# EAGLE design stm32H7_experimenter10 (EAGLE 6.5.0)
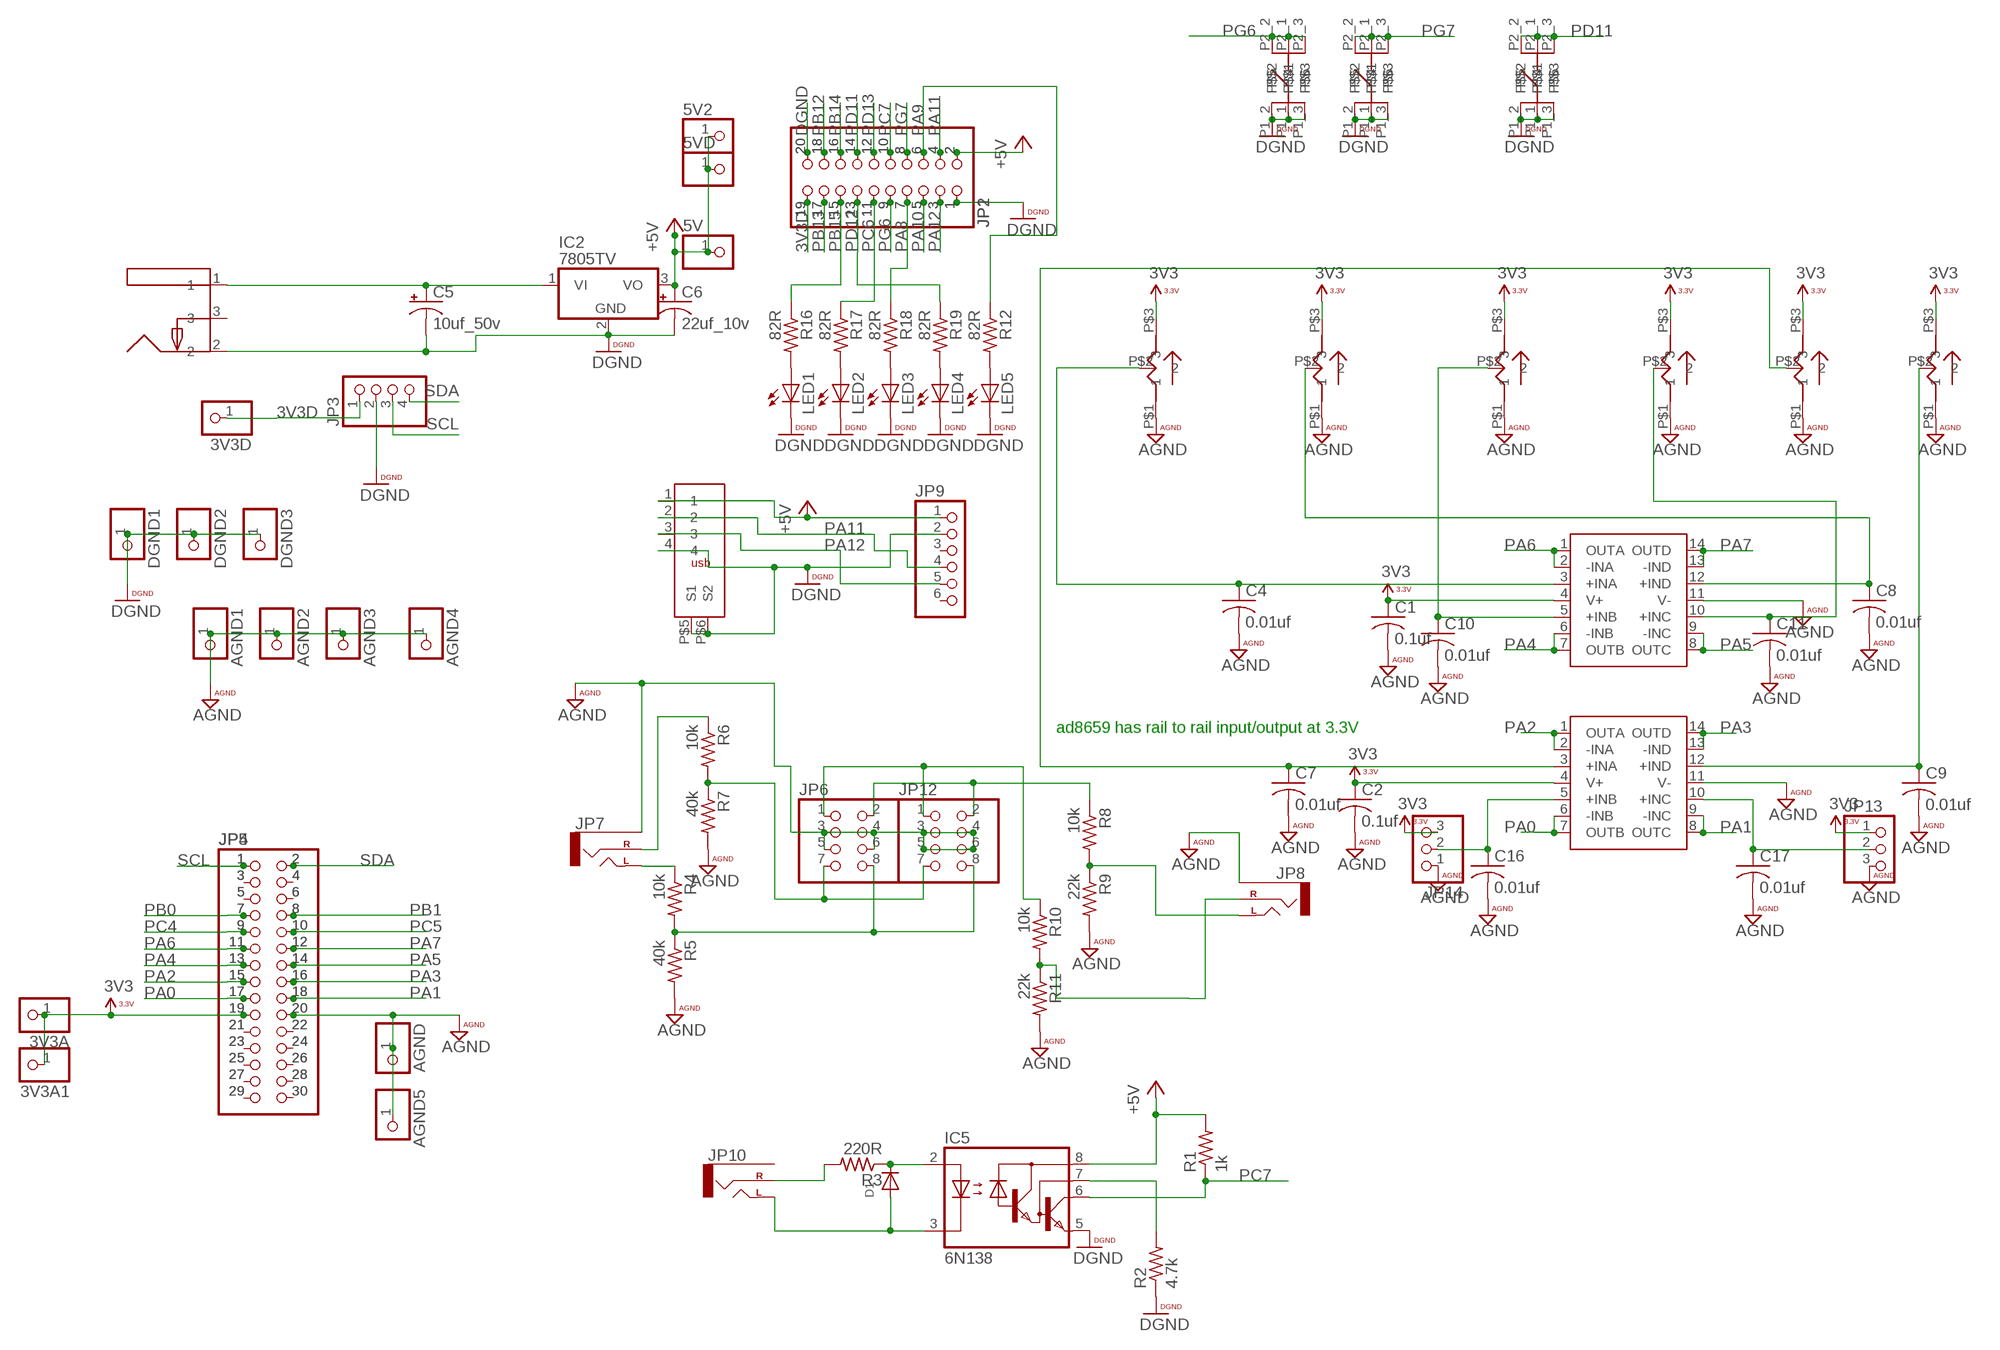
[diagram p0: schematic, sheet 1]

## Parts
3V3A  PINHD-1X1  [1X01]
3V3A1  PINHD-1X1  [1X01]
3V3D  PINHD-1X1  [1X01]
5V  PINHD-1X1  [1X01]
5V2  PINHD-1X1  [1X01]
5VD  PINHD-1X1  [1X01]
AGND  PINHD-1X1  [1X01]
AGND1  PINHD-1X1  [1X01]
AGND2  PINHD-1X1  [1X01]
AGND3  PINHD-1X1  [1X01]
AGND4  PINHD-1X1  [1X01]
AGND5  PINHD-1X1  [1X01]
C1  0.1uf  C-US025-030X050  [C025-030X050]
C2  0.1uf  C-US025-030X050  [C025-030X050]
C4  0.01uf  C-US025-030X050  [C025-030X050]
C5  10uf_50v  CPOL-USSMCC  [SMC_C]
C6  22uf_10v  CPOL-USSMCC  [SMC_C]
C7  0.01uf  C-US025-030X050  [C025-030X050]
C8  0.01uf  C-US025-030X050  [C025-030X050]
C9  0.01uf  C-US025-030X050  [C025-030X050]
C10  0.01uf  C-US025-030X050  [C025-030X050]
C11  0.01uf  C-US025-030X050  [C025-030X050]
C16  0.01uf  C-US025-030X050  [C025-030X050]
C17  0.01uf  C-US025-030X050  [C025-030X050]
D1  DIODEDO-1N4148  [DO-1N4148]
DGND1  PINHD-1X1  [1X01]
DGND2  PINHD-1X1  [1X01]
DGND3  PINHD-1X1  [1X01]
IC1  AD8659  [SO14]
IC2  7805TV  [TO220V]
IC3  AD8659  [SO14]
IC5  6N138  [DIL08]
JP1  PINHD-2X10  [2X10]
JP2  PINHD-2X10  [2X10]
JP3  PINHD-1X4  [1X04]
JP4  PINHD-2X15  [2X15]
JP5  PINHD-2X15  [2X15]
JP6  PINHD-2X4  [2X04]
JP7  AUDIO-JACKPTH  [AUDIO-JACK]
JP8  AUDIO-JACKPTH  [AUDIO-JACK]
JP9  PINHD-1X6  [1X06]
JP10  AUDIO-JACKPTH  [AUDIO-JACK]
JP12  PINHD-2X4  [2X04]
JP13  PINHD-1X3  [1X03]
JP14  PINHD-1X3  [1X03]
LED1  LED3MM  [LED3MM]
LED2  LED3MM  [LED3MM]
LED3  LED3MM  [LED3MM]
LED4  LED3MM  [LED3MM]
LED5  LED3MM  [LED3MM]
P1  RK09SONGHUEI  [R0904N]
P2  RK09SONGHUEI  [R0904N]
P3  RK09SONGHUEI  [R0904N]
P4  RK09SONGHUEI  [R0904N]
P5  RK09SONGHUEI  [R0904N]
P6  RK09SONGHUEI  [R0904N]
R1  1k  R-US_0204/5  [0204/5]
R2  4.7k  R-US_0204/5  [0204/5]
R3  220R  R-US_0204/5  [0204/5]
R4  10k  R-US_0204/5  [0204/5]
R5  40k  R-US_0204/5  [0204/5]
R6  10k  R-US_0204/5  [0204/5]
R7  40k  R-US_0204/5  [0204/5]
R8  10k  R-US_0204/5  [0204/5]
R9  22k  R-US_0204/5  [0204/5]
R10  10k  R-US_0204/5  [0204/5]
R11  22k  R-US_0204/5  [0204/5]
R12  82R  R-US_0204/5  [0204/5]
R16  82R  R-US_0204/2V  [0204V]
R17  82R  R-US_0204/2V  [0204V]
R18  82R  R-US_0204/5  [0204/5]
R19  82R  R-US_0204/5  [0204/5]
S1  TL52_PLUS  [TL52_PLUS]
S2  TL52_PLUS  [TL52_PLUS]
S3  TL52_PLUS  [TL52_PLUS]
U$1  PJ-058AH_PWR_JACK  [PJ-058AH]
U$3  USB_292303-1  [292303]

## Nets
3V3A: 3V3A1.1 3V3A.1 C1.1 C2.1 IC1.4(V+) IC3.4(V+) JP4.19 JP5.19 JP13.1 JP14.3 P1.P$3 P2.P$3 P3.P$3 P4.P$3 P5.P$3 P6.P$3 ; supply symbol labelled 3V3
3V3D: 3V3D.1 JP1.19 JP2.19 JP3.1
+5V: 5V2.1 5V.1 5VD.1 C6.+ IC2.3(VO) IC5.8(VCC) JP1.2 JP2.2 JP9.1 R1.2 U$3.1
AGND: AGND1.1 AGND2.1 AGND3.1 AGND4.1 AGND5.1 AGND.1 C1.2 C2.2 C4.2 C7.2 C8.2 C9.2 C10.2 C11.2 C16.2 C17.2 IC1.11(V-) IC3.11(V-) JP4.20 JP5.20 JP6.3 JP6.4 JP6.5 JP6.6 JP7.SLEEVE JP8.SLEEVE JP12.3 JP12.4 JP12.5 JP12.6 JP13.3 JP14.1 P1.P$1 P2.P$1 P3.P$1 P4.P$1 P5.P$1 P6.P$1 R5.2 R7.2 R9.2 R11.2
DGND: C5.- C6.- DGND1.1 DGND2.1 DGND3.1 IC2.2(GND) IC5.5(GND) JP1.1 JP1.20 JP2.1 JP2.20 JP3.2 JP9.2 LED1.K(C) LED2.K(C) LED3.K(C) LED4.K(C) LED5.K(C) R2.1 S1.P1_1 S1.P1_2 S1.P1_3 S2.P1_1 S2.P1_2 S2.P1_3 S3.P1_1 S3.P1_2 S3.P1_3 U$1.2 U$3.4 U$3.P$5(S1) U$3.P$6(S2)
N$1: D1.A IC5.3(C) JP10.TIP(LEFT)
N$2: D1.C IC5.2(A) R3.1
N$3: IC5.7(VB) R2.2
N$4: JP10.RING(RIGHT) R3.2
N$5: C4.1 IC1.3(+INA) P1.P$2
N$6: C8.1 IC1.12(+IND) P2.P$2
N$7: C10.1 IC1.5(+INB) P3.P$2
N$8: C11.1 IC1.10(+INC) P4.P$2
N$9: JP4.3 JP5.3
N$10: JP4.4 JP5.4
N$11: JP4.5 JP5.5
N$12: JP4.6 JP5.6
N$13: C7.1 IC3.3(+INA) P5.P$2
N$14: C9.1 IC3.12(+IND) P6.P$2
N$15: JP4.21 JP5.21
N$16: JP4.22 JP5.22
N$17: C5.+ IC2.1(VI) U$1.1
N$18: C16.1 IC3.5(+INB) JP14.2
N$19: JP6.8 JP12.8 R4.2 R5.1
N$20: JP6.7 JP12.7 R6.2 R7.1
N$21: LED5.A R12.2
N$22: JP7.TIP(LEFT) R4.1
N$23: JP8.TIP(LEFT) R8.2 R9.1
N$24: C17.1 IC3.10(+INC) JP13.2
N$25: JP7.RING(RIGHT) R6.1
N$26: JP6.2 JP12.2 R8.1
N$27: JP8.RING(RIGHT) R10.2 R11.1
N$28: JP6.1 JP12.1 R10.1
N$31: LED1.A R16.2
N$32: LED2.A R17.2
N$33: LED3.A R18.2
N$34: LED4.A R19.2
N$37: JP4.23 JP5.23
N$38: JP4.24 JP5.24
N$39: JP4.25 JP5.25
N$40: JP4.26 JP5.26
N$41: JP4.27 JP5.27
N$42: JP4.28 JP5.28
N$43: JP4.29 JP5.29
N$44: JP4.30 JP5.30
PA0: IC3.6(-INB) IC3.7(OUTB) JP4.17 JP5.17
PA1: IC3.8(OUTC) IC3.9(-INC) JP4.18 JP5.18
PA2: IC3.1(OUTA) IC3.2(-INA) JP4.15 JP5.15
PA3: IC3.13(-IND) IC3.14(OUTD) JP4.16 JP5.16
PA4: IC1.6(-INB) IC1.7(OUTB) JP4.13 JP5.13
PA5: IC1.8(OUTC) IC1.9(-INC) JP4.14 JP5.14
PA6: IC1.1(OUTA) IC1.2(-INA) JP4.11 JP5.11
PA7: IC1.13(-IND) IC1.14(OUTD) JP4.12 JP5.12
PA8: JP1.7 JP2.7 R18.1
PA9: JP1.6 JP2.6 R12.1
PA10: JP1.5 JP2.5
PA11: JP1.4 JP2.4 JP9.4 U$3.2
PA12: JP1.3 JP2.3 JP9.5 U$3.3
PB0: JP4.7 JP5.7
PB1: JP4.8 JP5.8
PB12: JP1.18 JP2.18
PB13: JP1.17 JP2.17
PB14: JP1.16 JP2.16
PB15: JP1.15 JP2.15 R16.1
PC4: JP4.9 JP5.9
PC5: JP4.10 JP5.10
PC6: JP1.11 JP2.11 R17.1
PC7: IC5.6(VO) JP1.10 JP2.10 R1.1
PD11: JP1.14 JP2.14 S3.P2_1 S3.P2_2 S3.P2_3
PD12: JP1.13 JP2.13 R19.1
PD13: JP1.12 JP2.12
PG6: JP1.9 JP2.9 S1.P2_1 S1.P2_2 S1.P2_3
PG7: JP1.8 JP2.8 S2.P2_1 S2.P2_2 S2.P2_3
SCL: JP3.3 JP4.1 JP5.1
SDA: JP3.4 JP4.2 JP5.2
Unconnected: JP9.3 JP9.6 JP10.SLEEVE U$1.3

## Notes on the sheet
- ad8659 has rail to rail input/output at 3.3V

## Library data of the parts
3V3A 3V3A1 3V3D 5V 5V2 5VD AGND AGND1-AGND5 DGND1-DGND3 = adafruit:PINHD-1X1: Pin header 1x1 for 0.1" spacing With round pins; PARTNO: *DNP
C1 C2 = adafruit:C-US: CAPACITOR, American symbol; PARTNO: K104K15X7RF5TL2
C4 C7-C11 C16 C17 = adafruit:C-US: CAPACITOR, American symbol; PARTNO: K103K15X7RF5TL2
C5 = rcl:CPOL-US: POLARIZED CAPACITOR, American symbol; PARTNO: 293D106X9035C2TE3
C6 = rcl:CPOL-US: POLARIZED CAPACITOR, American symbol; PARTNO: T491C226K016AT
D1 = adafruit:DIODE: Diode SMADIODE - SMA Surface Mount Package 20V 1A Schottky Diode Digikey: 641-1014-6-ND DO-1N4148 - Through Hole Small Current Diode SOD-123 20V 1 A (.5mV Vf) Schottky Diode - Digikey: MBRX120TPMSCT-ND SOD-323 10V 570mA (.38mV Vf, 3ns) Schottky Diode - Digikey: ZLLS410CT-ND SOD-523 30V 30mA Schottky Diode (RB751S-40TE61) - Digikey: RB751S-40TE61CT-ND SOT23-R/W - SOT23 Package (R = Solder Paste/Reflow Ovens, W = Hand-Soldering) BAT54Film 40V 300mA - Digikey: 497-7162-1-ND; PARTNO: 1N4148
IC1 IC3 = custom:AD8659; PARTNO: AD8659ARZ-R7
IC2 = linear:78*: Positive VOLTAGE REGULATOR Source: http://cache.national.com/ds/LM/LM78L05.pdf http://www.fairchildsemi.com/ds/LM/LM7805.pdf; PARTNO: VX7805-1000
IC5 = optocoupler:6N138: MOTOROLA OPTO COUPLER; MF: VISHAY/TELEFUNKEN; MPN: 6N138; OC_FARNELL: 9860150; OC_NEWARK: 35K5294; PARTNO: 6N138
JP1 = SparkFun-Connectors:PINHD-2X10: PIN HEADER; PARTNO: *DNP
JP2 = SparkFun-Connectors:PINHD-2X10: PIN HEADER; PARTNO: 67996-120HLF
JP3 = pinhead:PINHD-1X4: PIN HEADER; PARTNO: *DNP
JP4 = pinhead:PINHD-2X15: PIN HEADER; PARTNO: 67996-130HLF
JP5 = pinhead:PINHD-2X15: PIN HEADER; PARTNO: *DNP
JP6 = pinhead:PINHD-2X4: PIN HEADER; PARTNO: 67996-108HLF
JP7 JP8 JP10 = SparkFun-Connectors:AUDIO-JACK: 3.5mm Audio Jack Simple 3.5mm common PCB mount audio jack. SKU: PRT-08032; PARTNO: SJ1-3525N
JP9 = adafruit:PINHD-1X6: PIN HEADER
JP12 = pinhead:PINHD-2X4: PIN HEADER; PARTNO: *DNP
JP13 JP14 = adafruit:PINHD-1X3: PIN HEADER; PARTNO: *DNP
LED1-LED5 = custom:LED: LED OSRAM: - CHIPLED LG R971, LG N971, LY N971, LG Q971, LY Q971, LO R971, LY R971 LH N974, LH R974 LS Q976, LO Q976, LY Q976 LO Q996 - Hyper CHIPLED LW Q18S LB Q993, LB Q99A, LB R99A - SideLED LS A670, LO A670, LY A670, LG A670, LP A670 LB A673, LV A673, LT A673, LW A673 LH A674 LY A675 LS A676, LA A676, LO A676, LY A676, LW A676 LS A679, LY A679, LG A679 - Hyper Micro SIDELED® LS Y876, LA Y876, LO Y876, LY Y876 LT Y87S - SmartLED LW L88C, LW L88S LB L89C, LB L89S, LG L890 LS L89K, LO L89K, LY L89K LS L896, LA L896, LO L896, LY L896 - TOPLED LS T670, LO T670, LY T670, LG T670, LP T670 LSG T670, LSP T670, LSY T670, LOP T670, LYG T670 LG T671, LOG T671, LSG T671 LB T673, LV T673, LT T673, LW T673 LH T674 LS T676, LA T676, LO T676, LY T676, LB T676, LH T676, LSB T676, LW T676 LB T67C, LV T67C, LT T67C, LS T67K, LO T67K, LY T67K, LW E67C LS E67B, LA E67B, LO E67B, LY E67B, LB E67C, LV E67C, LT E67C LW T67C LS T679, LY T679, LG T679 LS T770, LO T770, LY T770, LG T770, LP T770 LB T773, LV T773, LT T773, LW T773 LH T774 LS E675, LA E675, LY E675, LS T675 LS T776, LA T776, LO T776, LY T776, LB T776 LHGB T686 LT T68C, LB T68C - Hyper Mini TOPLED® LB M676 - Mini TOPLED Santana® LG M470 LS M47K, LO M47K, LY M47K Source: http://www.osram.convergy.de - LUMILED® LXK2-PW12-R00, LXK2-PW12-S00, LXK2-PW14-U00, LXK2-PW14-V00 LXK2-PM12-R00, LXK2-PM12-S00, LXK2-PM14-U00 LXK2-PE12-Q00, LXK2-PE12-R00, LXK2-PE12-S00, LXK2-PE14-T00, LXK2-PE14-U00 LXK2-PB12-K00, LXK2-PB12-L00, LXK2-PB12-M00, LXK2-PB14-N00, LXK2-PB14-P00, LXK2-PB14-Q00 LXK2-PR12-L00, LXK2-PR12-M00, LXK2-PR14-Q00, LXK2-PR14-R00 LXK2-PD12-Q00, LXK2-PD12-R00, LXK2-PD12-S00 LXK2-PH12-R00, LXK2-PH12-S00 LXK2-PL12-P00, LXK2-PL12-Q00, LXK2-PL12-R00 Source: www.luxeon.com; PARTNO: 151031SS04000
P1-P6 = custom:RK09; PARTNO: *
R1 = adafruit:R-US_: RESISTOR, American symbol; PARTNO: RNMF14FTC1K00
R2 = adafruit:R-US_: RESISTOR, American symbol; PARTNO: RNMF14FTC4K70
R3 = adafruit:R-US_: RESISTOR, American symbol; PARTNO: RNMF14FTC220R
R4 R6 R8 R10 = adafruit:R-US_: RESISTOR, American symbol; PARTNO: RNMF14FTC10K0
R5 R7 = adafruit:R-US_: RESISTOR, American symbol; PARTNO: RNMF14FTC39K0
R9 R11 = adafruit:R-US_: RESISTOR, American symbol; PARTNO: RNMF14FTC22K0
R12 R16-R19 = adafruit:R-US_: RESISTOR, American symbol; PARTNO: RNMF14FTC82R0
S1-S3 = custom:TL52_PLUS; PARTNO: TL52AF160Q
U$1 = custom:PJ-058AH_PWR_JACK
U$3 = custom:USB_292303-1

## Board
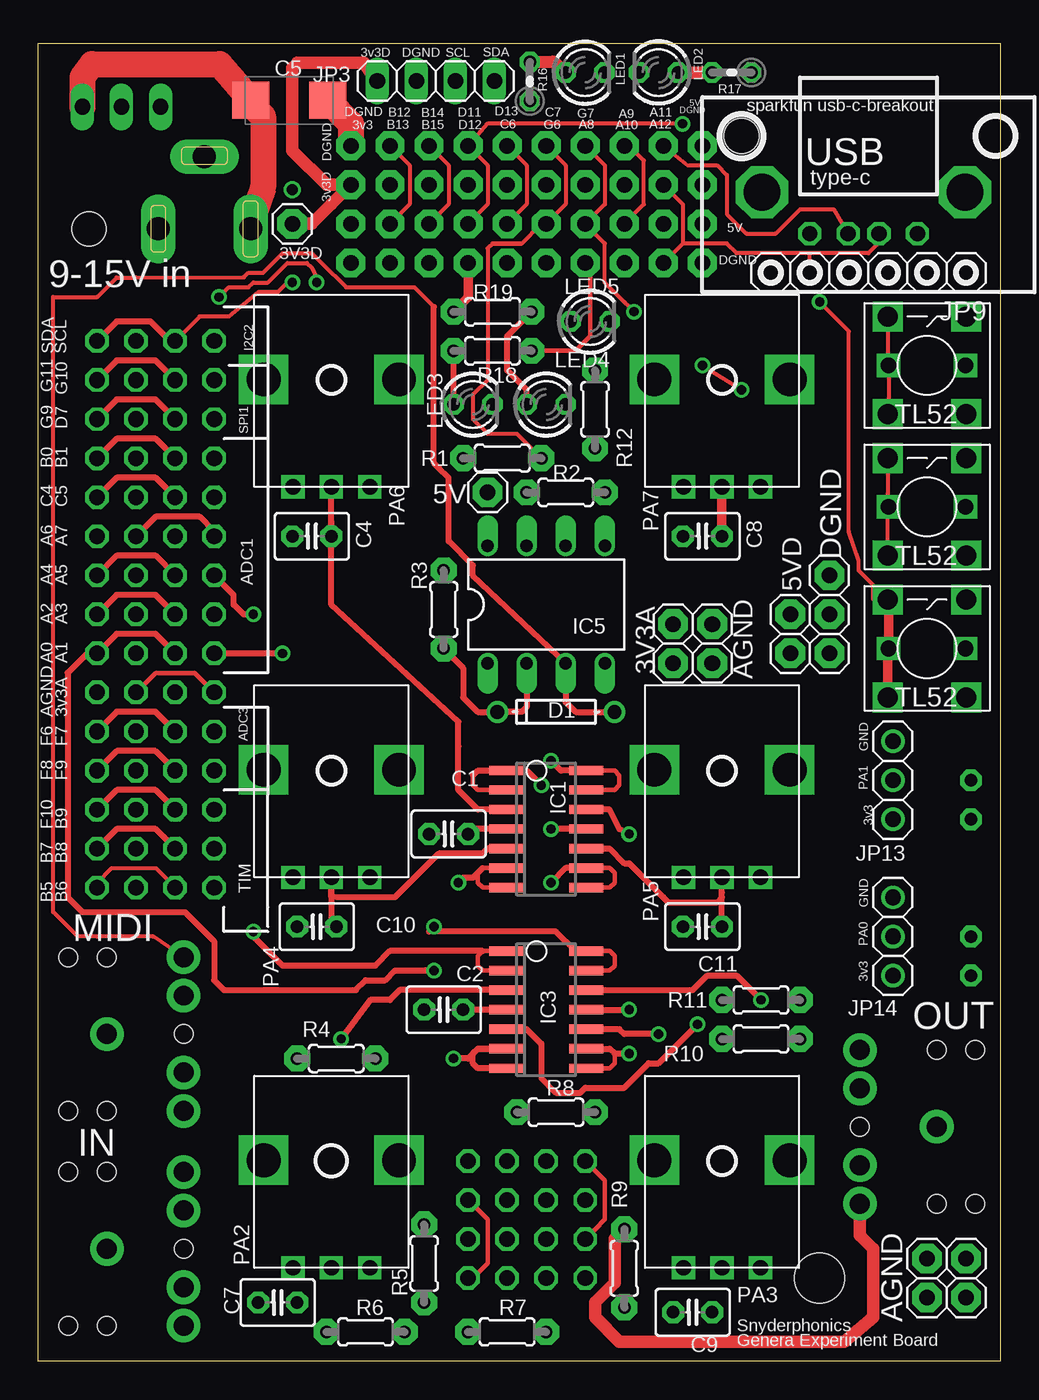
[diagram p1: board, top side]
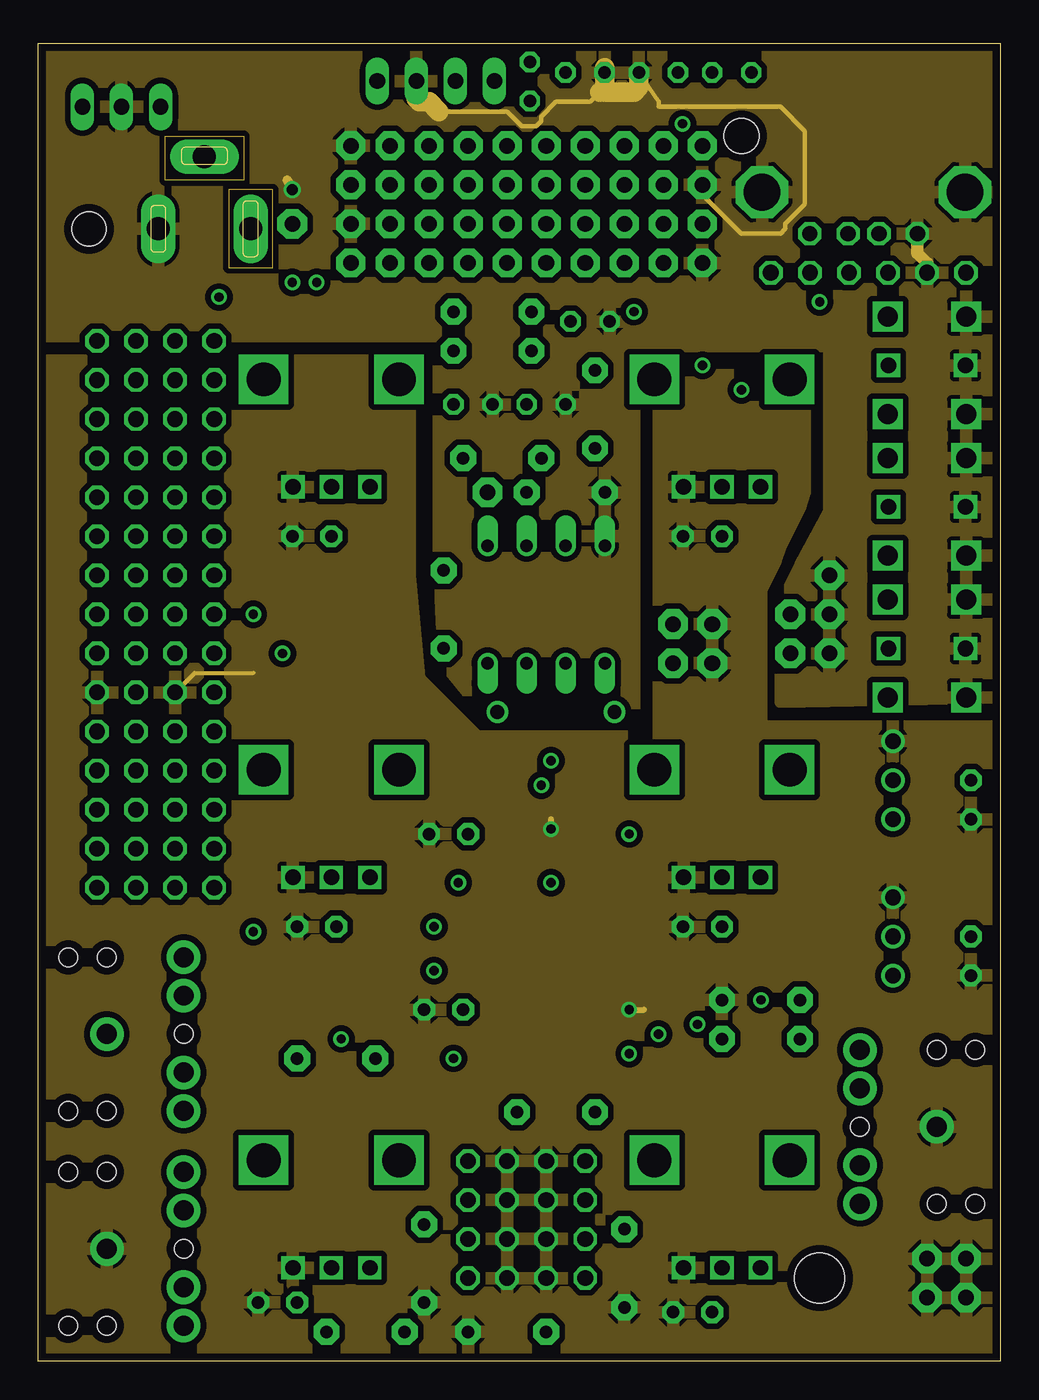
[diagram p2: board, inner layer Route2]
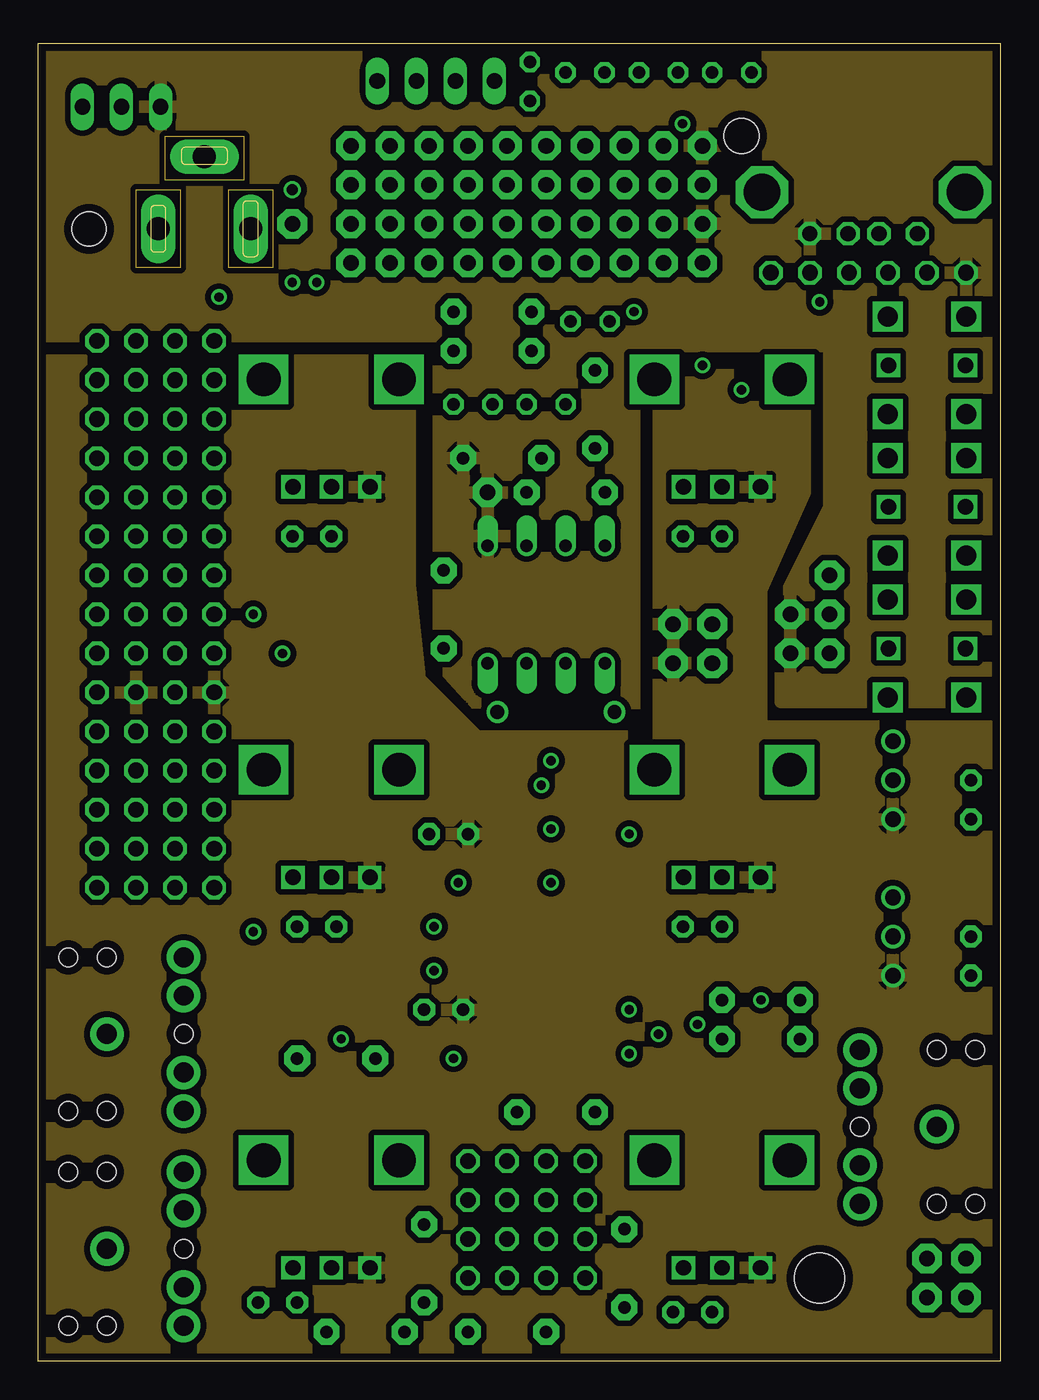
[diagram p3: board, inner layer Route15]
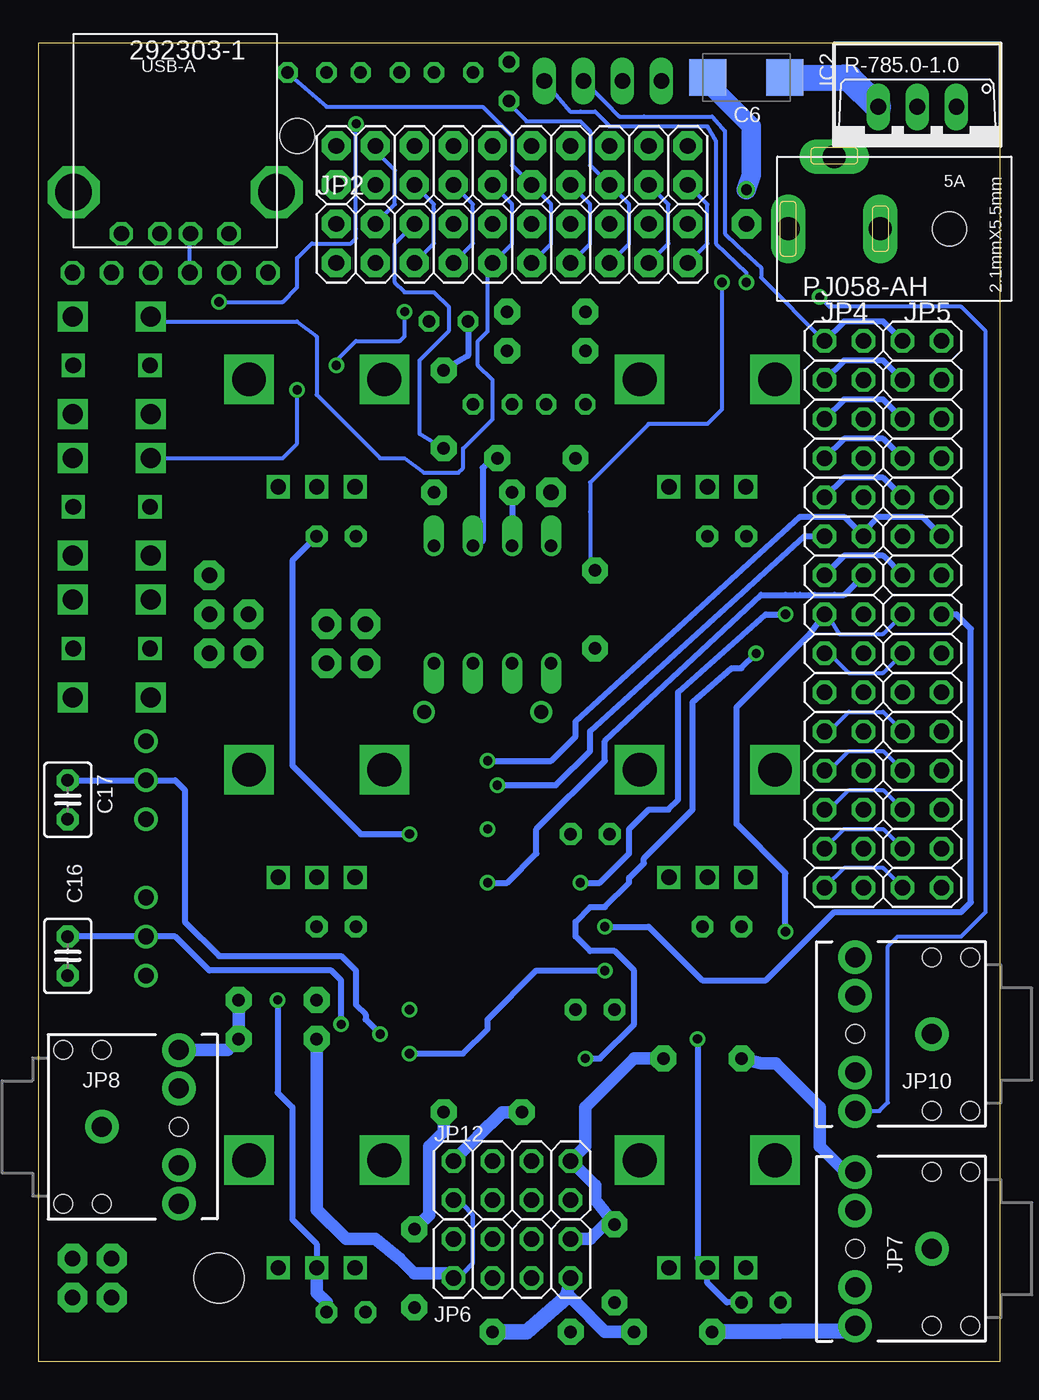
[diagram p4: board, bottom side, seen from below]

Size 62.55 x 85.72 mm. Coordinates in mm from the lower left corner, seen from the top.
Outline: 0,85.72 62.55,85.72 62.55,0.32 62.55,0 0,0 0,85.72
Copper layers (1+2+3*14+15+16): Top 0.035mm / dielectric 1mm / Route2 0.035mm / dielectric 1mm / Route3 0.035mm / dielectric 0.2mm / Route14 0.035mm / dielectric 0.15mm / Route15 0.035mm / dielectric 1mm / Bottom 0.035mm
Design rules "default *": minimum track width 8mil, minimum drill 9mil, track to track 9mil, track to pad 8mil, pad to pad 8mil, via to via 9mil, smd to smd 7mil, copper to edge 20mil, drill to drill 10mil, minimum pad ring 10mil, minimum via ring 8mil, stop-mask expansion 3mil, vias tented up to drill 0mil, thermal gap 10mil
Holes 3.26 mm at 50.8,5.4
Holes 2.26 mm at 45.72,79.69
Milling: 4 lines

### Footprints (pad centres in the part's own frame; a part is rotated, then mirrored left to right if it is on the bottom)
1X01 = drill 1.016 pad 1.93 octagon: 1 0,0
C025-030X050 = drill 0.813 pad 1.422 octagon: 1 -1.27,0; 2 1.27,0
SMC_C = smd 2.4 x 2.4: + -2.5,0; - 2.5,0
DO-1N4148 = drill 0.9: A -3.81,0; C 3.81,0
SO14 = smd 0.6 x 2.2: 1 -3.81,-2.6; 2 -2.54,-2.6; 3 -1.27,-2.6; 4 0,-2.6; 5 1.27,-2.6; 6 2.54,-2.6; 7 3.81,-2.6; 8 3.81,2.6; 9 2.54,2.6; 10 1.27,2.6; 11 0,2.6; 12 -1.27,2.6; 13 -2.54,2.6; 14 -3.81,2.6
TO220V = drill 1.016 long: 1 -2.54,-2.54; 2 0,-2.54; 3 2.54,-2.54
DIL08 = drill 0.813 offset: 1 -3.81,-3.81; 2 -1.27,-3.81; 3 1.27,-3.81; 4 3.81,-3.81; 5 3.81,3.81; 6 1.27,3.81; 7 -1.27,3.81; 8 -3.81,3.81
2X10 = drill 1.016 pad 1.88 octagon: 1 -11.43,-1.27; 2 -11.43,1.27; 3 -8.89,-1.27; 4 -8.89,1.27; 5 -6.35,-1.27; 6 -6.35,1.27; 7 -3.81,-1.27; 8 -3.81,1.27; 9 -1.27,-1.27; 10 -1.27,1.27; 11 1.27,-1.27; 12 1.27,1.27; 13 3.81,-1.27; 14 3.81,1.27; 15 6.35,-1.27; 16 6.35,1.27; 17 8.89,-1.27; 18 8.89,1.27; 19 11.43,-1.27; 20 11.43,1.27
1X04 = drill 1.016 long: 1 -3.81,0; 2 -1.27,0; 3 1.27,0; 4 3.81,0
2X15 = drill 1.016 octagon: 1 -17.78,-1.27; 2 -17.78,1.27; 3 -15.24,-1.27; 4 -15.24,1.27; 5 -12.7,-1.27; 6 -12.7,1.27; 7 -10.16,-1.27; 8 -10.16,1.27; 9 -7.62,-1.27; 10 -7.62,1.27; 11 -5.08,-1.27; 12 -5.08,1.27; 13 -2.54,-1.27; 14 -2.54,1.27; 15 0,-1.27; 16 0,1.27; 17 2.54,-1.27; 18 2.54,1.27; 19 5.08,-1.27; 20 5.08,1.27; 21 7.62,-1.27; 22 7.62,1.27; 23 10.16,-1.27; 24 10.16,1.27; 25 12.7,-1.27; 26 12.7,1.27; 27 15.24,-1.27; 28 15.24,1.27; 29 17.78,-1.27; 30 17.78,1.27
2X04 = drill 1.016 octagon: 1 -3.81,-1.27; 2 -3.81,1.27; 3 -1.27,-1.27; 4 -1.27,1.27; 5 1.27,-1.27; 6 1.27,1.27; 7 3.81,-1.27; 8 3.81,1.27
AUDIO-JACK = drill 1.3 pad 2.184: RING 5,5; RSH 5,2.5; SLEEVE 0,0; TIP 5,-5; TSH 5,-2.5 | hole 1.2: 0,5; -2.5,5; -2.5,-5; 0,-5; 5,0
1X06 = drill 1.016 octagon: 1 -6.35,0; 2 -3.81,0; 3 -1.27,0; 4 1.27,0; 5 3.81,0; 6 6.35,0
1X03 = drill 1.016: 1 -2.54,0; 2 0,0; 3 2.54,0
LED3MM = drill 0.813 octagon: A -1.27,0; K 1.27,0
R0904N = drill 1 square: P$1 -2.5,-6.95; P$2 0,-6.95; P$3 2.5,-6.95 | drill 2.2 square: P$4 -4.4,0.05; P$5 4.4,0.05
0204/5 = drill 0.813 pad 1.676 octagon: 1 -2.54,0; 2 2.54,0
0204V = drill 0.813 octagon: 1 -1.27,0; 2 1.27,0
TL52_PLUS = drill 1.016 square: P1_1 -2.5,0; P2_1 2.5,0 | drill 1.3 square: P1_2 -2.54,3.175; P1_3 -2.54,-3.175; P2_2 2.54,3.175; P2_3 2.54,-3.175
PJ-058AH = drill 1.5 long: 1 3,0; 2 -3,0; 3 0,-4.7 | hole 2.2: -7.5,0
292303 = drill 1 octagon: 1 -3.5,0; 2 -1,0; 3 1,0; 4 3.5,0 | drill 2.38 octagon: P$5 -6.6,-2.7; P$6 6.6,-2.7

### Placement (x,y rotation side)
3V3A  41.27,47.94 0 top
3V3A1  41.27,45.4 0 top
3V3D  16.51,73.98 0 top
5V  29.21,56.52 0 top
5V2  48.9,46.04 0 top
5VD  48.9,48.58 0 top
AGND  43.81,47.94 0 top
AGND1  60.33,6.67 0 top
AGND2  60.33,4.13 0 top
AGND3  57.78,6.67 0 top
AGND4  57.78,4.13 0 top
AGND5  43.81,45.4 0 top
C1  26.67,34.29 180 top
C2  26.35,22.86 180 top
C4  17.78,53.66 180 top
C5  16.31,82.02 0 top
C6  16.51,83.5 180 bottom
C7  15.56,3.81 180 top
C8  43.18,53.66 180 top
C9  42.55,3.17 180 top
C10  18.1,28.26 180 top
C11  43.18,28.26 180 top
C16  60.64,26.35 270 bottom
C17  60.64,36.51 270 bottom
D1  33.66,42.23 180 top
DGND1  51.44,48.58 0 top
DGND2  51.44,51.12 0 top
DGND3  51.44,46.04 0 top
IC1  33.02,34.61 270 top
IC2  5.4,79.06 180 bottom
IC3  33.02,22.86 270 top
IC5  33.02,49.21 0 top
JP1  31.75,77.79 0 bottom
JP2  31.75,72.71 0 bottom
JP3  25.84,83.27 0 top
JP4  10.16,48.58 270 bottom
JP5  5.08,48.58 270 bottom
JP6  31.75,6.67 0 bottom
JP7  4.45,7.3 180 bottom
JP8  58.42,15.24 0 bottom
JP9  53.98,70.8 180 top
JP10  4.45,21.27 180 bottom
JP12  31.75,11.75 0 bottom
JP13  55.56,37.78 90 top
JP14  55.56,27.62 270 top
LED1  35.55,83.82 0 top
LED2  40.32,83.82 180 top
LED3  28.26,62.23 0 top
LED4  33.02,62.23 0 top
LED5  35.88,67.63 0 top
P1  19.05,63.82 0 top
P2  44.45,63.82 0 top
P3  19.05,38.42 0 top
P4  44.45,38.42 0 top
P5  19.05,13.02 0 top
P6  44.45,13.02 0 top
R1  30.16,58.74 180 top
R2  34.29,56.52 180 top
R3  26.35,48.9 90 top
R4  19.37,19.68 0 top
R5  25.08,6.35 270 top
R6  21.27,1.91 0 top
R7  30.48,1.91 180 top
R8  33.66,16.19 0 top
R9  38.1,6.03 270 top
R10  46.99,20.95 0 top
R11  46.99,23.5 180 top
R12  36.2,61.91 90 top
R16  31.95,83.24 90 top
R17  45.09,83.82 180 top
R18  29.53,65.72 180 top
R19  29.53,68.26 0 top
S1  57.78,64.77 180 top
S2  57.78,55.56 180 top
S3  57.78,46.35 180 top
U$1  10.79,73.66 180 bottom
U$3  53.66,73.34 180 bottom

### Tracks (layer width: path | path; a pad name or v marks a point on that pad's centre or on a via)
3V3A
  Top 0.305: JP4.19 10.16,44.77 7.62,44.77 JP5.19
  Top 0.406: IC1.4 28.26,34.61 C1.1 | IC3.4 C2.1
  pour Route15 (isolate 0.381): 0,65.09 24.13,65.09 24.13,50.48 24.77,44.77 24.77,44.45 28.57,40.64 38.73,40.64 40.32,39.05 40.32,64.14 49.85,64.14 49.85,56.52 46.99,50.16 46.99,41.27 61.91,41.27 61.91,0.32 0,0.32
3V3D
  Top 0.61: 16.83,84.45 16.51,84.14
  Top 0.813: JP3.1 21.17,84.45 16.83,84.45 | 16.51,84.14 16.51,78.74 18.73,76.52 JP1.19 19.05,75.25 17.78,73.98 3V3D.1
  Bottom 0.254: JP1.19 19.05,75.25 19.05,72.71 JP2.19
+5V
  Bottom 1.676: C6.+ 10.16,83.5 9.84,83.5 IC2.3
  pour Route15 (isolate 0.381): 0.64,85.72 62.23,85.72 62.23,52.39 61.59,51.75 61.59,42.86 48.26,42.86 48.26,49.21 51.44,55.56 51.44,66.04 38.73,66.04 38.73,42.23 38.1,41.91 29.21,41.91 26.04,45.4 26.04,66.67 0.32,66.67
AGND  (via drill 0.6)
  Top 0.406: IC3.11 v38.42,22.86 | IC1.11 33.66,34.61 v33.34,34.61
  Route2 0.254: 10.16,44.77 13.97,44.77
  Route2 0.305: 10.16,44.77 JP4.20
  Route2 0.406: v38.42,22.86 39.37,22.86 | v33.34,34.61 33.34,35.24
  pour Route2 (isolate 0.381): 0,65.09 24.13,65.09 24.13,51.12 24.77,44.45 28.57,40.64 38.73,40.64 40.32,39.05 40.32,64.14 49.85,64.14 49.85,56.52 49.53,55.56 48.26,53.02 47.94,52.07 46.99,50.16 46.99,41.27 62.23,41.27 62.23,0.64 0,0.64
DGND  (via drill 0.7)
  Top 1.676: C5.- 20.32,80.5 JP1.20
  Route2 0.305: 26.04,81.28 30.48,81.28 31.43,80.33 32.38,80.33 32.7,80.64 32.7,80.96 33.66,81.92 35.88,81.92 36.83,82.87 | JP1.1 43.18,75.88 45.72,73.34 48.26,73.34 48.58,73.66 48.58,73.98 49.85,75.25 49.85,80.01 48.26,81.6 40.32,81.6 40.32,81.92 LED2.K
  Route2 0.61: v16.51,76.2 16.19,76.83
  Route2 0.813: U$3.4 57.16,72.06 57.78,71.44 JP9.2
  Route2 1.27: LED2.K 39.05,82.87 38.73,82.55 36.83,82.55 36.82,82.56 LED1.K 36.83,84.14 36.83,82.87 36.51,82.55 | JP3.2 24.57,82.11 24.77,81.92 25.4,81.92 26.04,81.28
  Bottom 0.61: C6.- 19.01,83.14
  Bottom 1.27: 19.01,83.14 16.19,80.33 16.19,77.15 v16.51,76.2
  pour Route2 (isolate 0.381): 1.59,85.72 62.55,85.72 62.55,43.18 48.26,42.86 48.26,49.21 49.53,51.75 51.44,55.24 51.44,66.04 38.73,66.04 38.73,42.23 37.78,41.91 29.21,41.91 26.35,45.4 26.04,52.39 26.04,66.67 0.32,66.67 0.32,84.77
N$1
  Top 0.254: JP10.TIP 7.46,27.62 5.4,27.62 3.81,27.62 3.17,27.62 2.54,27.62 0.95,29.21 0.95,69.22 3.81,69.22 5.08,70.48 6.35,70.48 13.3,70.51 13.3,70.5 13.35,70.5 13.65,70.8 14.61,70.8 15.24,71.44 15.88,72.07 17.78,72.07 18.41,71.44 20,69.85 24.45,69.85 25.72,68.58
  Top 0.406: D1.A 34.92,42.23 34.29,42.86 34.29,44.13 IC5.3 28.26,51.12 28.26,51.75 26.67,53.34 26.67,57.47 26.04,58.1 25.72,58.42 25.72,68.58
N$2
  Top 0.406: R3.1 27.62,45.09 27.62,43.18 28.57,42.23 D1.C 29.53,42.23 30.8,42.23 31.43,42.23 31.75,42.55 IC5.2
N$3
  Bottom 0.406: R2.2 IC5.7
N$4  (via drill 0.6)
  Top 0.254: v11.75,69.22 12.38,69.85 13.65,69.85 13.97,70.17 14.92,70.17 15.88,71.12 16.19,71.44 17.46,71.44 17.78,71.12 18.1,70.48 v18.1,70.17
  Bottom 0.254: JP10.RING 7.86,16.27 7.3,16.83 7.3,26.99 6.67,27.62 2.54,27.62 0.95,29.21 0.95,66.99 2.54,68.58 11.11,68.58 | 11.11,68.58 v11.75,69.22 11.11,68.58 | v18.1,70.17 18.1,61.91 19.05,60.96 22.86,60.96 26.67,57.15 26.67,55.24 26.67,51.75 R3.2
N$5
  Top 0.406: IC1.3 28.57,35.88 27.3,37.15 27.3,40.01 27.3,41.59 19.05,49.21 19.05,54.61 | 19.05,54.61 C4.1 19.05,54.61 | 19.05,54.61 P1.P$2
N$6  (via drill 0.6)
  Top 0.406: v38.42,34.29 37.78,34.61 37.15,35.88 IC1.12
  Top 0.61: P2.P$2 C8.1
  Bottom 0.406: C8.1 46.04,52.07 46.04,38.73 43.18,35.88 41.59,34.29 v38.42,34.29
N$7
  Top 0.406: IC1.5 29.21,33.34 28.89,33.02 26.04,33.02 23.18,30.16 20.32,30.16 19.37,30.16 19.05,30.2 | 19.05,30.2 P3.P$2 19.05,30.2 | 19.05,30.2 19.05,28.57 C10.1
N$8
  Top 0.406: IC1.10 37.15,33.34 38.1,32.38 38.42,32.38 40.64,30.16 40.96,29.84 44.13,29.84 44.45,30.16 44.45,30.48 | 44.45,30.48 P4.P$2 | C11.1 44.45,30.48
N$9
  Bottom 0.406: JP5.3 7.62,65.09 10.16,65.09 JP4.3
N$10
  Top 0.406: JP4.4 7.62,65.09 5.08,65.09 JP5.4
N$11
  Bottom 0.406: JP5.5 7.62,62.55 10.16,62.55 JP4.5
N$12
  Top 0.406: JP4.6 7.62,62.55 5.08,62.55 JP5.6
N$13  (via drill 0.6)
  Top 0.406: IC3.3 23.5,24.13 22.86,23.5 21.59,23.5 v19.68,20.95
  Bottom 0.406: C7.1 17.78,3.81 19.05,5.08 P5.P$2 19.68,6.7 v19.68,20.95
N$14  (via drill 0.6)
  Top 0.406: IC3.12 42.55,24.13 43.5,25.08 45.4,25.08 v46.99,23.5
  Bottom 0.406: v46.99,23.5 46.99,17.46 46.04,16.51 46.04,9.21 44.45,7.62 P6.P$2
  Bottom 0.813: C9.1 43.81,3.81 44.45,4.45 P6.P$2
N$15
  Bottom 0.254: JP4.21 11.11,40.96 9.84,42.23 7.62,42.23 JP5.21
N$16
  Top 0.406: JP4.22 7.62,42.23 5.08,42.23 JP5.22
N$17
  Top 1.27: 13.97,74.47 13.97,73.83 U$1.1
  Top 1.422: C5.+ 14.01,81.88
  Top 1.676: C5.+ 11.79,84.37 3.49,84.37 2.86,83.5 IC2.1 | 14.01,81.88 13.97,81.6 14.61,80.96 14.61,76.38 13.97,74.47
N$18  (via drill 0.6)
  Top 0.406: IC3.5 31.75,21.59 32.7,20.64 32.7,18.41 33.66,17.46 35.24,17.46 35.56,17.78 38.1,17.78 39.69,19.37 40.32,19.37 v42.86,21.91
  Bottom 0.406: v42.86,21.91 42.86,24.77 43.5,25.4 51.44,25.4 53.66,27.62 55.24,27.62 JP14.2 C16.1
N$19
  Bottom 0.406: R5.1 25.4,9.21
  Bottom 0.813: 25.4,9.21 26.67,7.94 JP6.8 | R5.1 26.35,10.48 26.35,11.43 JP12.8 26.99,13.97 26.99,16.51 23.81,19.68 R4.2
N$20
  Top 0.305: JP12.7 29.21,9.21 29.21,6.35 28.57,5.71 28.26,5.71 JP6.7
  Bottom 0.813: JP6.7 28.26,4.13 27.94,4.13 27.62,3.81 25.72,1.91 R6.2
  Bottom 1.016: R7.1 30.8,1.91 28.26,4.13
N$21
  Bottom 0.406: LED5.A 34.61,65.41 R12.2
N$22
  Bottom 0.813: JP7.TIP 10.08,12.3 11.75,13.97 11.75,16.51 14.61,19.37 15.56,19.37 R4.1
N$23
  Top 0.813: JP8.TIP 53.42,8.18 54.29,7.3 54.29,2.86 52.39,1.27 37.78,1.27 36.2,2.86 36.2,3.81 37.47,5.08 37.47,7.94 R9.1
  Bottom 0.813: R8.2 36.2,14.92 37.15,13.97 37.15,9.53 37.78,8.89 R9.1
N$24  (via drill 0.6)
  Top 0.406: v40.32,21.27 38.1,21.27 37.78,21.59 IC3.10
  Bottom 0.406: C17.1 JP13.2 53.66,37.78 53.02,37.15 53.02,28.57 50.8,26.35 42.86,26.35 41.91,25.4 41.91,23.18 41.27,22.54 41.27,22.23 v40.32,21.27
N$25
  Bottom 1.016: JP7.RING 9.76,1.99 R6.1
N$26
  Top 0.305: JP12.2 36.83,11.75 36.83,9.21 36.2,8.57 JP6.2
  Bottom 0.813: JP12.2 33.97,14.61 32.38,16.19 R8.1
N$27
  Bottom 0.813: JP8.RING 50.24,20.24 R10.2 R11.1
N$28
  Bottom 0.305: 35.88,5.71 34.92,5.71 34.29,6.35 34.29,9.53 34.92,10.16 35.24,10.16 JP12.1
  Bottom 0.813: R10.1 44.45,9.84 42.55,7.94 40.64,7.94 39.05,6.67 38.1,5.71 35.88,5.71 JP6.1
N$29
  Route2 0: 12.38,76.2 12.38,71.12 15.24,71.12 15.24,76.2 12.38,76.2
N$30
  Route2 0: 8.89,79.69 13.34,79.69 13.34,76.83 8.26,76.83 8.26,79.69 8.89,79.69
N$31
  Top 0.813: LED1.A 33.47,84.53 R16.2
N$32
  Top 0.813: LED2.A 42.23,83.82 R17.2
N$33
  Top 0.406: R18.2 26.99,62.55 LED3.A
N$34
  Top 0.406: LED4.A 31.75,63.18 30.48,64.45 30.48,66.67 31.75,67.94 32.07,67.94 R19.2
N$35
  Route15 0: 12.38,76.2 15.24,76.2 15.24,71.12 12.38,71.12 12.38,76.2
N$36
  Route15 0: 8.26,79.69 13.34,79.69 13.34,76.83 8.26,76.83 8.26,79.69
N$37
  Bottom 0.254: JP4.23 11.11,38.42 9.84,39.69 7.62,39.69 JP5.23
N$38
  Top 0.406: JP4.24 7.62,39.69 5.08,39.69 JP5.24
N$39
  Bottom 0.254: JP4.25 11.11,35.88 9.84,37.15 7.62,37.15 JP5.25
N$40
  Top 0.406: JP4.26 7.62,37.15 5.08,37.15 JP5.26
N$41
  Bottom 0.254: JP4.27 10.16,34.61 7.62,34.61 JP5.27
N$42
  Top 0.406: JP4.28 7.62,34.61 5.08,34.61 JP5.28
N$43
  Bottom 0.254: JP5.29 7.62,32.07 10.16,32.07 JP4.29
N$44
  Top 0.254: JP5.30 3.81,31.11 4.76,32.07 7.62,32.07 JP4.30
N$45
  Route15 0: 6.67,76.2 9.21,76.2 9.21,71.44 9.21,71.12 6.35,71.12 6.35,76.2 6.67,76.2
PA0  (via drill 0.6)
  Top 0.406: JP4.17 13.34,46.04 v15.88,46.04 | IC3.7 28.57,19.05 28.26,19.37 28.26,20 28.57,20.32 | 28.57,20.32 IC3.6 28.57,20.32 | 28.57,20.32 27.94,19.68 v26.99,19.68
  Bottom 0.254: JP4.17 11.11,46.04 9.84,44.77 7.62,44.77 JP5.17
  Bottom 0.406: v26.99,19.68 26.04,19.68 23.81,21.91 23.81,25.4 25.08,26.67 26.67,26.67 27.62,27.62 27.62,28.57 26.67,29.53 25.72,29.53 24.13,31.11 24.13,31.43 23.18,32.38 23.18,32.7 20,35.88 20,42.86 17.46,45.09 16.83,45.09 v15.88,46.04
PA1  (via drill 0.6)
  Top 0.305: IC3.9 37.15,20.32 37.47,20 37.47,19.37 37.15,19.05 IC3.8
  Top 0.406: IC3.9 37.15,20.32 37.47,20 v38.42,20 | 25.08,25.4 23.18,25.4 22.54,24.77 21.27,24.77 20.64,24.13 12.06,24.13 11.43,24.77 11.43,27.3 9.53,29.21 2.86,29.21 1.91,30.16 1.91,44.77 3.17,46.04 JP5.18 5.08,47.31 7.62,47.31 JP4.18 | 25.08,25.4 v25.72,25.4 25.08,25.4
  Bottom 0.406: v38.42,20 34.92,20 33.34,21.59 33.34,22.23 30.16,25.4 v25.72,25.4
PA2  (via drill 0.6)
  Top 0.305: IC3.1 28.89,26.67 28.57,26.35 28.57,25.72 28.89,25.4 IC3.2
  Top 0.406: 28.89,26.67 22.86,26.67 21.91,25.72 15.88,25.72 13.97,27.62 v13.97,27.94
  Bottom 0.254: JP4.15 11.43,48.9 10.48,47.31 7.62,47.31 JP5.15
  Bottom 0.406: v13.97,27.94 13.97,31.75 17.14,34.92 17.14,42.55 12.38,47.31 JP4.15
PA3  (via drill 0.6)
  Top 0.305: IC3.14 37.15,26.67 37.47,26.35 37.47,25.72 37.15,25.4 IC3.13
  Top 0.406: IC3.14 34.92,26.67 33.66,27.94 25.4,27.94 v25.72,28.26 | JP4.16 7.62,49.85 5.08,49.85 JP5.16
  Bottom 0.406: v25.72,28.26 22.86,28.26 | 22.86,28.26 19.37,24.77 | 22.86,28.26 19.37,24.77 | 19.37,24.77 15.24,24.77 10.79,29.21 2.54,29.21 1.91,29.84 1.91,47.62 2.86,48.58 JP5.16
PA4  (via drill 0.6)
  Top 0.305: IC1.6 28.89,32.07 28.57,31.75 28.57,31.11 28.89,30.8 IC1.7
  Top 0.406: JP4.13 12.7,49.85 12.7,49.21 13.34,48.58 v13.97,48.58 | 28.89,32.07 28.26,31.43 27.62,31.43 v27.3,31.11
  Bottom 0.406: JP5.13 7.62,52.39 10.16,52.39 JP4.13 | v27.3,31.11 26.04,31.11 24.13,33.02 24.13,34.61 22.86,35.88 21.59,35.88 20.95,36.51 20.95,43.5 15.24,48.58 v13.97,48.58
PA5  (via drill 0.6)
  Top 0.305: IC1.9 37.15,32.07 37.47,31.75 37.47,31.11 37.15,30.8 IC1.8
  Top 0.406: IC1.9 34.29,32.07 v33.34,31.11 | JP4.14 7.62,52.39 5.08,52.39 JP5.14
  Bottom 0.406: v33.34,31.11 32.07,31.11 30.16,33.02 30.16,34.61 25.72,39.05 25.72,40.32 15.56,49.85 13.97,49.85 13.34,49.85 13.02,49.85 12.06,49.85 10.79,49.85 10.16,49.85 JP4.14
PA6  (via drill 0.6)
  Top 0.305: IC1.1 28.57,38.42 28.26,38.1 28.26,37.47 28.57,37.15 IC1.2
  Top 0.406: 28.26,38.1 28.57,38.42 31.75,38.42 v32.7,37.47 | JP4.11 11.43,53.98 10.48,54.93 7.62,54.93 JP5.11
  Bottom 0.406: v32.7,37.47 28.89,37.47 26.67,39.69 26.67,40.32 26.67,40.96 12.7,53.66 12.38,53.66 JP4.11
PA7  (via drill 0.6)
  Top 0.305: IC1.14 37.47,38.42 37.78,38.1 37.78,37.47 37.47,37.15 IC1.13
  Top 0.406: IC1.14 33.97,38.42 v33.34,39.05
  Bottom 0.406: v33.34,39.05 29.21,39.05 27.62,40.64 27.62,41.59 13.02,54.93 10.16,54.93 JP4.12 8.89,53.98 7.94,54.93 5.08,54.93 JP5.12
PA8
  Top 0.305: R18.1 34.92,65.72 35.88,66.67 35.88,71.12
  Top 0.406: 35.88,71.12 JP2.7
  Bottom 0.254: JP1.7 34.29,75.25 34.29,72.71 JP2.7 35.56,71.12
  Bottom 0.406: 35.88,70.8 35.56,71.12
PA9
  Top 0.254: JP1.6 38.42,79.06 39.37,78.11 39.37,75.25 JP2.6
  Bottom 0.254: JP2.6 39.37,72.71 39.37,70.17 38.73,69.53 36.83,69.53 35.88,68.58 35.88,66.99 37.47,65.41 37.78,65.09 37.78,60.33 R12.1
PA10
  Bottom 0.254: JP1.5 36.83,75.25 36.83,74.93 36.83,72.71 JP2.5 38.42,71.44
PA11
  Top 0.254: JP1.4 42.23,77.79 44.13,77.79 44.77,77.15 44.77,74.61 46.04,73.34 47.94,73.34 49.53,74.93 51.7,74.93 U$3.2
  Bottom 0.254: JP1.4 40.96,79.06 39.37,77.47 39.37,75.25 JP2.4 | JP9.4 52.7,72.75 U$3.2
PA12
  Top 0.254: JP1.3 41.91,75.25 41.91,72.71 | 41.91,72.71 JP2.3 | U$3.3 54.66,72.75 53.98,72.07 50.16,72.07 | 50.16,72.07 45.4,72.07 44.77,72.71 41.91,72.71 | JP9.5 50.16,72.07
PB0
  Bottom 0.406: JP5.7 7.62,60.01 10.16,60.01 JP4.7
PB1
  Top 0.406: JP4.8 7.62,60.01 5.08,60.01 JP5.8
PB12
  Top 0.254: JP1.18 24.13,77.79 24.13,75.25 JP2.18
PB13
  Bottom 0.254: JP1.17 21.59,75.25 21.59,72.71 JP2.17
PB14
  Top 0.254: JP1.16 26.67,77.79 26.67,75.25 JP2.16
PB15
  Bottom 0.254: R16.1 32.07,81.66 31.75,81.6 30.8,80.64 27.62,80.64 27.3,80.64 26.67,80.01 26.67,77.79 JP1.15 24.13,75.25 24.13,72.71 JP2.15
PC4
  Bottom 0.406: JP5.9 7.62,57.47 10.16,57.47 JP4.9
PC5
  Top 0.406: JP4.10 7.62,57.47 5.08,57.47 JP5.10
PC6
  Bottom 0.254: R17.1 43.81,81.6 33.66,81.6 32.7,80.64 31.75,79.69 31.75,77.79 JP1.11 29.21,75.25 29.21,72.71 JP2.11
PC7
  Top 0.254: JP1.10 34.29,77.79 34.29,75.25 JP2.10 32.7,73.98 31.43,72.71 | 29.21,72.39 29.53,72.71 | 29.53,72.71 29.84,72.71 31.43,72.71 | 31.43,72.71 29.53,72.71 | 29.53,72.71 29.21,72.39 | 29.21,72.39 29.21,63.82 28.26,62.87 28.26,61.28 29.21,60.33 31.11,60.33 R1.1
  Bottom 0.406: R1.1 33.02,58.74 33.66,58.1 33.66,53.34 IC5.6
PD11  (via drill 0.6)
  Top 0.254: JP2.14 29.21,75.25 29.21,77.79 JP1.14 29.18,80.49 v41.88,80.49 | S3.P2_3 54.29,49.53 54.29,50.48 53.98,50.8 53.34,51.44 53.34,52.07 52.7,53.98 52.7,66.99 v50.8,68.9
  Top 0.61: S3.P2_2 55.24,46.31 S3.P2_1 55.28,49.49 S3.P2_3
  Bottom 0.254: v50.8,68.9 46.67,68.9 45.72,69.85 45.72,71.75 44.77,72.71 42.23,72.71 41.91,73.03 41.91,73.66 41.91,80.33 v41.88,80.49
PD12
  Top 0.61: R19.1 27.94,69.22 JP2.13
  Bottom 0.254: JP1.13 26.67,75.25 26.67,72.71 JP2.13
PD13
  Top 0.254: JP1.12 31.75,77.79 31.75,75.25 31.11,74.61 JP2.12
PG6
  Top 0.254: S1.P2_3 55.24,65.76 S1.P2_1 55.28,62.59 S1.P2_2
  Bottom 0.254: JP1.9 31.75,75.25 31.75,72.71 JP2.9 33.34,71.12 33.34,66.99 33.97,66.36 33.97,64.77 33.02,63.82 33.02,61.28 34.92,59.37 34.92,58.1 35.24,57.78 37.47,57.78 38.73,58.74 40.32,58.74 44.45,62.87 44.45,66.67 45.72,67.63 54.93,67.63 S1.P2_3
PG7  (via drill 0.6)
  Top 0.254: S2.P2_3 55.24,56.55 S2.P2_1 55.24,56.48 S2.P2_2 | JP1.8 36.83,77.79 36.83,75.25 JP2.8 36.83,72.71 36.83,70.17 38.1,68.9 38.42,68.58 v38.73,68.26 | v45.72,63.18 v43.18,64.77
  Bottom 0.254: S2.P2_3 46.99,58.74 46.67,58.74 45.72,59.69 v45.72,63.18 | v43.18,64.77 43.18,65.09 41.91,66.36 39.05,66.36 38.73,66.67 v38.73,68.26
SCL
  Bottom 0.254: JP3.3 26.99,83.46 26.99,83.19 25.72,81.92 24.77,80.96 23.18,80.96 18.73,80.96 17.91,80.01 17.91,73.34 17.14,72.61 15.88,71.44 15.56,71.12 15.56,70.48 JP4.1
  Bottom 0.406: JP5.1 7.62,67.63 10.16,67.63 JP4.1
SDA  (via drill 0.6)
  Top 0.254: v16.51,70.17 16.19,70.17 15.56,69.53 14.29,69.53 12.38,67.94 10.48,67.94 JP4.2
  Top 0.406: JP4.2 8.57,66.36 7.62,67.31 7.3,67.63 5.08,67.63 JP5.2
  Bottom 0.254: JP3.4 27.98,81.28 27.3,81.28 26.35,81.28 25.4,80.33 19.05,80.33 18.49,79.38 18.49,72.71 16.51,70.8 v16.51,70.17
(copper drawn outside any net)
  shapes: Bottom area x3, Top area x3

### Text on the board
tPlace: 3v3D | DGND | SCL | SDA | DGND | B12 | B14 | D11 | D13 | C7 | A11 | 5V | 3v3 | B13 | B15 | D12 | C6 | G6 | A8 | G7 | A9 | A10 | A12 | DGND | sparkfun usb-c-breakout | DGND | USB | type-c | 3v3D | 5V | DGND | 9-15V in | SDA | SCL | I2C2 | G11 | G10 | G9 | D7 | SPI1 | B0 | B1 | DGND | C4 | C5 | PA6 | PA7 | A6 | A7 | A4 | A5 | ADC1 | A2 | A3 | A0 | A1 | ADC3 | AGND | 3v3A | F6 | F7 | GND | PA1 | F8 | F9 | 3v3 | F10 | B9 | B7 | B8 | TIM | B5 | B6 | GND | PA5 | PA0 | MIDI | PA4 | 3v3 | OUT | IN | PA2 | PA3 | AGND | Snyderphonics | Genera Experiment Board
bPlace: R-785.0-1.0 | USB-A